# EAGLE design Old Shutter Driver with OptoCouplers (EAGLE 7.2.0)
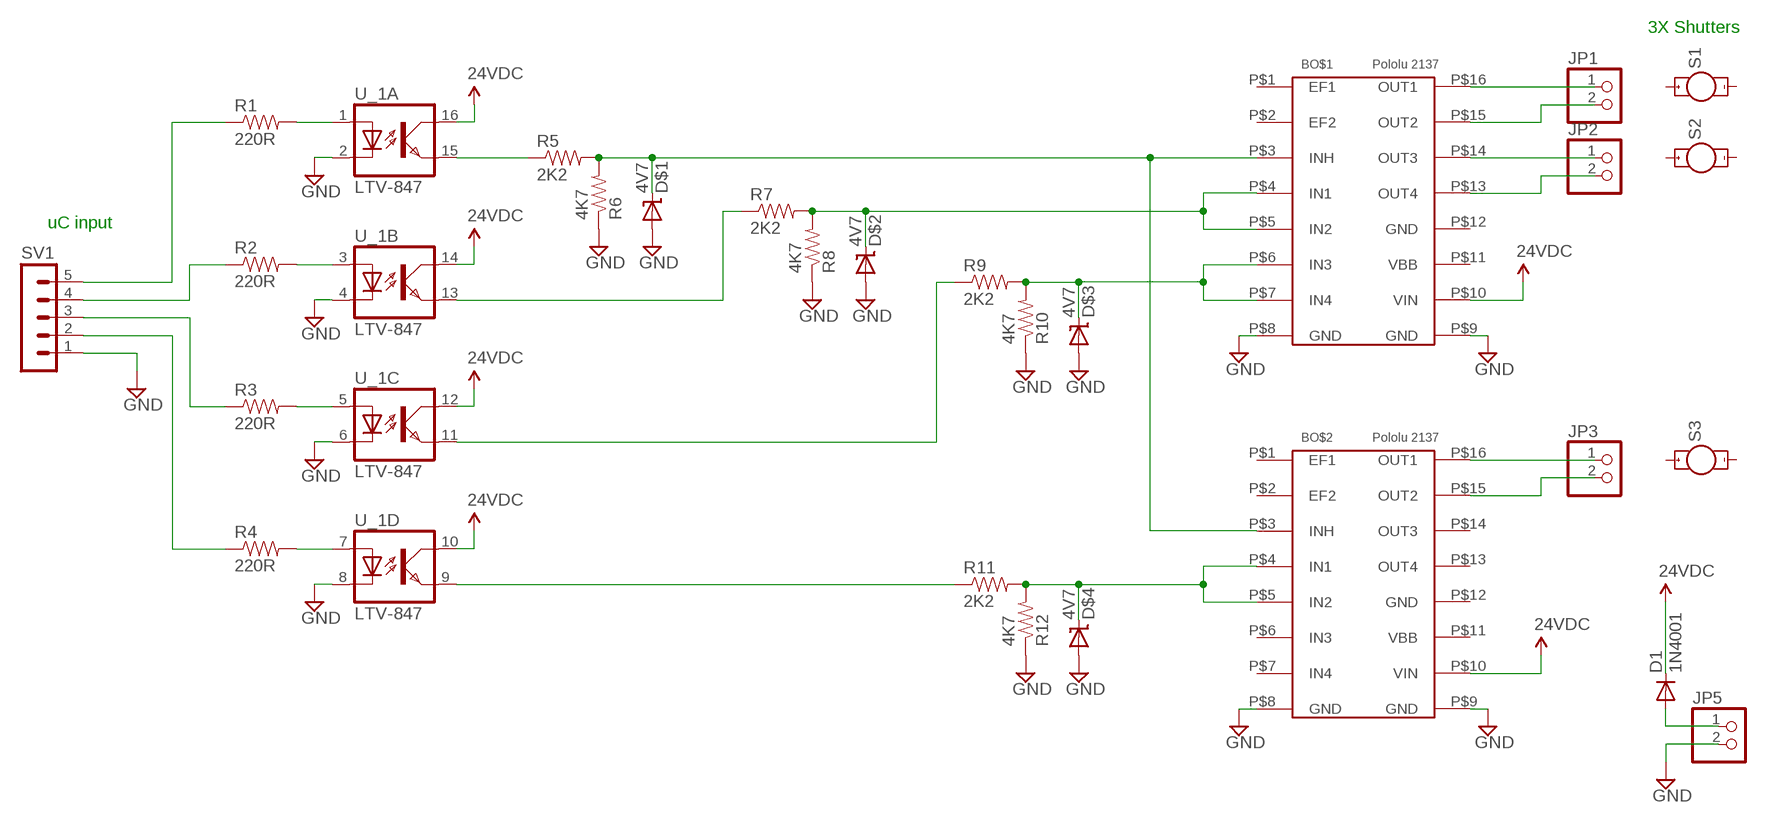
[diagram p0: schematic, sheet 1]

## Parts
BO$1  Pololu 2137  POLOLU2137  [POLOLU2137]
BO$2  Pololu 2137  POLOLU2137  [POLOLU2137]
D1  1N4001  1N4004  [DO41-10]
D$1  4V7  DIODE-ZENERPTH  [DIODE-ZENER]
D$2  4V7  DIODE-ZENERPTH  [DIODE-ZENER]
D$3  4V7  DIODE-ZENERPTH  [DIODE-ZENER]
D$4  4V7  DIODE-ZENERPTH  [DIODE-ZENER]
JP1  PINHD-1X2  [1X02]
JP2  PINHD-1X2  [1X02]
JP3  PINHD-1X2  [1X02]
JP5  PINHD-1X2  [1X02]
R1  220R  RESISTORAXIAL-0.3  [AXIAL-0.3]
R2  220R  RESISTORAXIAL-0.3  [AXIAL-0.3]
R3  220R  RESISTORAXIAL-0.3  [AXIAL-0.3]
R4  220R  RESISTORAXIAL-0.3  [AXIAL-0.3]
R5  2K2  RESISTORAXIAL-0.3  [AXIAL-0.3]
R6  4K7  RESISTORAXIAL-0.3  [AXIAL-0.3]
R7  2K2  RESISTORAXIAL-0.3  [AXIAL-0.3]
R8  4K7  RESISTORAXIAL-0.3  [AXIAL-0.3]
R9  2K2  RESISTORAXIAL-0.3  [AXIAL-0.3]
R10  4K7  RESISTORAXIAL-0.3  [AXIAL-0.3]
R11  2K2  RESISTORAXIAL-0.3  [AXIAL-0.3]
R12  4K7  RESISTORAXIAL-0.3  [AXIAL-0.3]
S1  MOTOR10MM  [VIBE-MOTOR-10MM]
S2  MOTOR10MM  [VIBE-MOTOR-10MM]
S3  MOTOR10MM  [VIBE-MOTOR-10MM]
SV1  MA05-1  [MA05-1]
U_1  LTV-847  LT847  [DIL16]

## Nets
GND: BO$1.P$8(GND) BO$1.P$9(GND) BO$2.P$8(GND) BO$2.P$9(GND) D$1.P$2(A) D$2.P$2(A) D$3.P$2(A) D$4.P$2(A) JP5.2 R6.P$1 R8.P$1 R10.P$1 R12.P$1 U_1.2(A:C) U_1.4(B:C) U_1.6(C:C) U_1.8(D:C)
INHIBIT1: BO$1.P$3(INH) BO$2.P$3(INH) D$1.P$1(C) R5.P$2 R6.P$2
INHIBIT2: BO$1.P$4(IN1) BO$1.P$5(IN2) D$2.P$1(C) R7.P$2 R8.P$2
INHIBIT3: BO$1.P$6(IN3) BO$1.P$7(IN4) D$3.P$1(C) R9.P$2 R10.P$2
INHIBIT4: BO$2.P$4(IN1) BO$2.P$5(IN2) D$4.P$1(C) R11.P$2 R12.P$2
N$1: BO$1.P$16(OUT1) JP1.1
N$2: BO$1.P$15(OUT2) JP1.2
N$3: R5.P$1 U_1.15(A:EMIT)
N$4: R7.P$1 U_1.13(B:EMIT)
N$5: R9.P$1 U_1.11(C:EMIT)
N$6: R11.P$1 U_1.9(D:EMIT)
N$7: R1.P$2 U_1.1(A:A)
N$8: R2.P$2 U_1.3(B:A)
N$9: R3.P$2 U_1.5(C:A)
N$10: R4.P$2 U_1.7(D:A)
N$11: BO$1.P$14(OUT3) JP2.1
N$12: BO$1.P$13(OUT4) JP2.2
N$13: BO$2.P$16(OUT1) JP3.1
N$14: BO$2.P$15(OUT2) JP3.2
N$15: D1.A JP5.1
N$18: R1.P$1 SV1.5
N$19: R2.P$1 SV1.4
N$20: R3.P$1 SV1.3
N$21: R4.P$1 SV1.2
VCC: BO$1.P$10(VIN) BO$2.P$10(VIN) D1.C U_1.10(D:COL) U_1.12(C:COL) U_1.14(B:COL) U_1.16(A:COL) ; supply symbol labelled 24VDC
Unconnected: BO$1.P$1(EF1) BO$1.P$2(EF2) BO$2.P$1(EF1) BO$2.P$2(EF2) BO$2.P$6(IN3) BO$2.P$7(IN4) BO$2.P$13(OUT4) BO$2.P$14(OUT3) S1.+ S1.- S2.+ S2.- S3.+ S3.- SV1.1

## Notes on the sheet
- 3X Shutters
- uC input

## Power pins joined to a net without a drawn wire
GND: BO$1.P$12(GND) BO$2.P$12(GND)
VBB: BO$1.P$11(VBB) BO$2.P$11(VBB)

## Library data of the parts
BO$1 BO$2 = au:POLOLU2137: Pololu item #2137 - Dual H-Bridge motor driver Details: Allegro A4990 controller DC motors 6 V to 32 V, 0.7 A each Peak current 0.9 A Inputs 3V and 5V compatible $5.95 each in November 2014 from pololu.com
D1 = adafruit:1N4004: DIODE General purpose 1N400x type rectifier (With bigger pads) http://www.ladyada.net/library/pcb/eaglelibrary.html
D$1-D$4 = SparkFun-DiscreteSemi:DIODE-ZENER: Zener Diode Production Part - 8199 3.4V Zener Voltage
JP1-JP3 JP5 = pinhead:PINHD-1X2: PIN HEADER
R1-R12 = SparkFun-Passives:RESISTOR: Resistor Basic schematic elements and footprints for 0603, 1206, and PTH resistors.
S1-S3 = SparkFun-Electromechanical:MOTOR: Vibration Motor- ROB-08449 Physical dimension and wire connections for this powerful vibration motor. Motor has a self adhesive backing.
SV1 = con-lstb:MA05-1: PIN HEADER; OC_FARNELL: unknown; OC_NEWARK: unknown
U_1 = LTV847:LT847

## Board
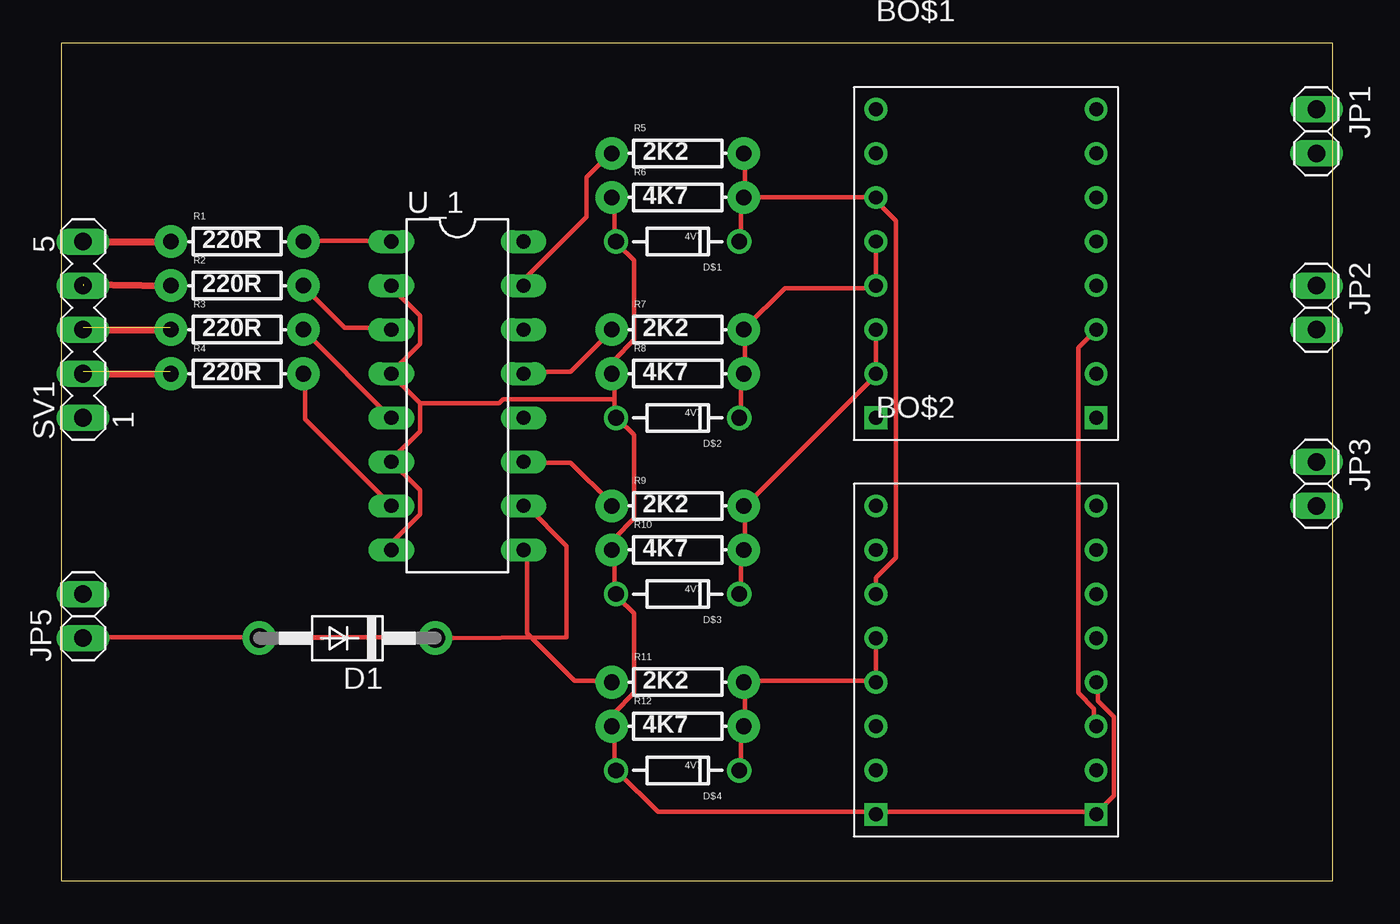
[diagram p1: board, top side]
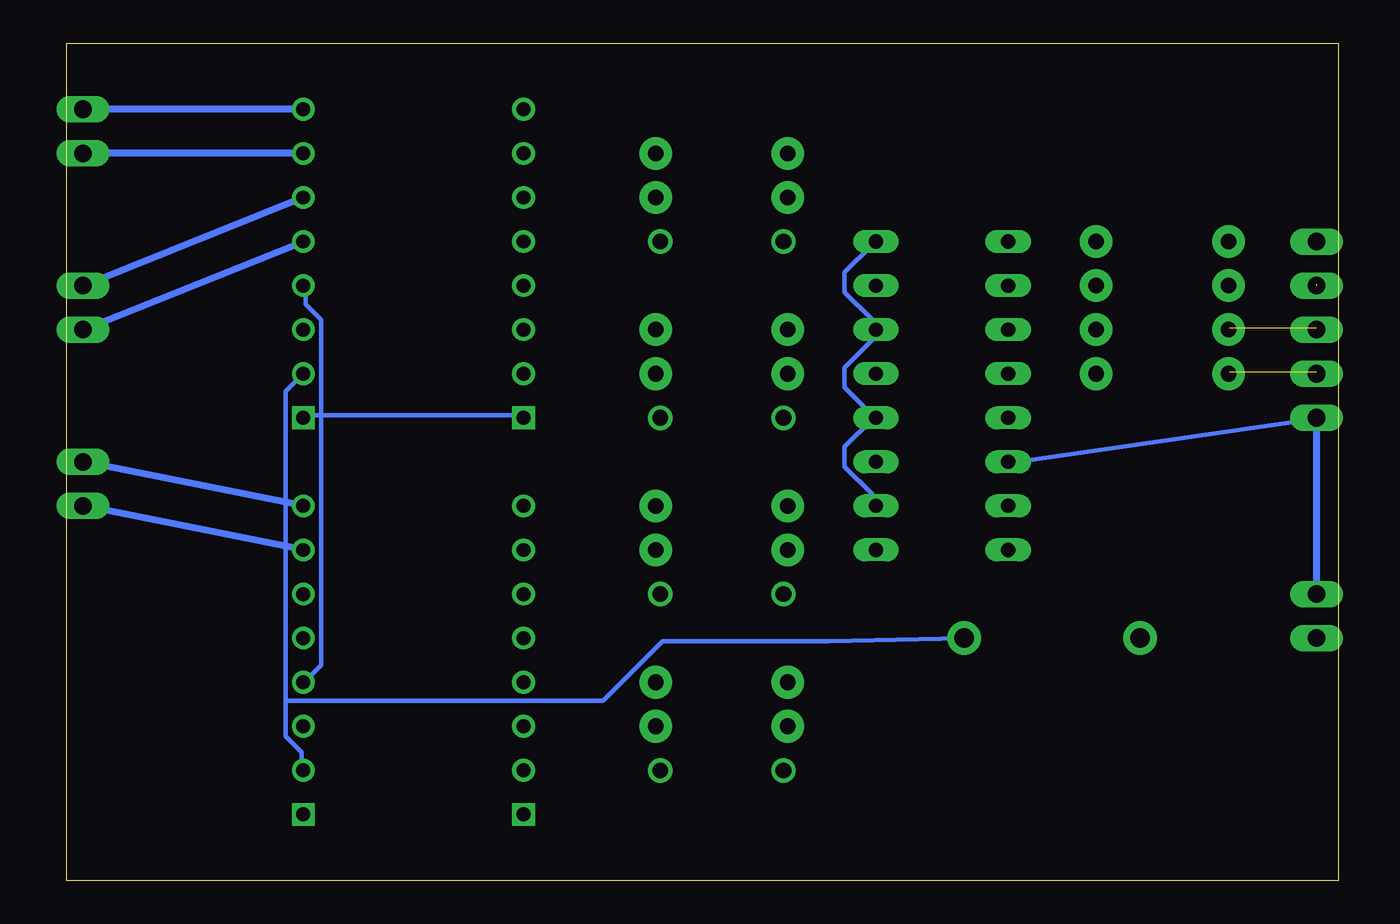
[diagram p2: board, bottom side, seen from below]

Size 73.33 x 48.25 mm. Coordinates in mm from the lower left corner, seen from the top.
Outline: 0,0 73.33,0 73.33,48.25 0,48.25 0,0
Copper layers (1*16): Top 0.035mm / dielectric 1.5mm / Bottom 0.035mm
Design rules "default": minimum track width 10mil, minimum drill 24mil, track to track 8mil, track to pad 8mil, pad to pad 8mil, via to via 8mil, smd to smd 8mil, copper to edge 40mil, drill to drill 8mil, minimum pad ring 10mil, minimum via ring 8mil, stop-mask expansion 4mil, vias tented up to drill 0mil, thermal gap 10mil

### Footprints (pad centres in the part's own frame; a part is rotated, then mirrored left to right if it is on the bottom)
POLOLU2137 = drill 0.8: P$1 -6.35,8.89; P$2 -6.35,6.35; P$3 -6.35,3.81; P$4 -6.35,1.27; P$5 -6.35,-1.27; P$6 -6.35,-3.81; P$7 -6.35,-6.35; P$10 6.35,-6.35; P$11 6.35,-3.81; P$12 6.35,-1.27; P$13 6.35,1.27; P$14 6.35,3.81; P$15 6.35,6.35; P$16 6.35,8.89 | drill 0.8 square: P$8 -6.35,-8.89; P$9 6.35,-8.89
DO41-10 = drill 1.118 pad 1.93: A 5.08,0; C -5.08,0
DIODE-ZENER = drill 0.9: P$1 -3.556,0; P$2 3.556,0
1X02 = drill 1.016 long: 1 -1.27,0; 2 1.27,0
AXIAL-0.3 = drill 0.9 pad 1.88: P$1 -3.81,0; P$2 3.81,0
VIBE-MOTOR-10MM = drill 0.8 pad 1.676: + -5,-3.9; - -6.35,-2.54
MA05-1 = drill 1.016 long: 1 -5.08,0; 2 -2.54,0; 3 0,0; 4 2.54,0; 5 5.08,0
DIL16 = drill 0.813 long: 1 -8.89,-3.81; 2 -6.35,-3.81; 3 -3.81,-3.81; 4 -1.27,-3.81; 5 1.27,-3.81; 6 3.81,-3.81; 7 6.35,-3.81; 8 8.89,-3.81; 9 8.89,3.81; 10 6.35,3.81; 11 3.81,3.81; 12 1.27,3.81; 13 -1.27,3.81; 14 -3.81,3.81; 15 -6.35,3.81; 16 -8.89,3.81

### Placement (x,y rotation side)
BO$1  53.34,35.56 0 top
BO$2  53.34,12.7 0 top
D1  16.51,13.97 180 top
D$1  35.56,36.83 180 top
D$2  35.56,26.67 180 top
D$3  35.56,16.51 180 top
D$4  35.56,6.35 180 top
JP1  72.39,43.18 270 top
JP2  72.39,33.02 270 top
JP3  72.39,22.86 270 top
JP5  1.27,15.24 90 top
R1  10.16,36.83 0 top
R2  10.16,34.29 0 top
R3  10.16,31.75 0 top
R4  10.16,29.21 0 top
R5  35.56,41.91 0 top
R6  35.56,39.37 0 top
R7  35.56,31.75 0 top
R8  35.56,29.21 0 top
R9  35.56,21.59 0 top
R10  35.56,19.05 0 top
R11  35.56,11.43 0 top
R12  35.56,8.89 0 top
S1  85.09,21.59 270 top  (outside the outline)
S2  85.09,31.75 270 top  (outside the outline)
S3  85.09,41.91 270 top  (outside the outline)
SV1  1.27,31.75 90 top
U_1  22.86,27.94 270 top

### Tracks (layer width: path | path; a pad name or v marks a point on that pad's centre or on a via)
GND
  Top 0.254: U_1.8 19.1,19.05 19.1,19.51 20.7,21.11 20.7,22.48 U_1.6 19.1,24.31 20.7,25.91 20.7,27.51 | U_1.2 19.1,34.14 20.7,32.54 20.7,30.94 19.1,29.34 U_1.4 19.1,29.11 20.7,27.51 | 46.99,3.96 59.56,3.96 BO$2.P$9 59.79,3.96 60.71,4.88 60.71,9.45 59.79,10.36 59.79,11.28 BO$2.P$12 | 31.9,19.05 31.9,16.53 D$3.P$2 32.13,16.31 33.05,15.39 33.05,10.82 31.9,9.68 31.9,8.99 R12.P$1 31.9,8.76 31.9,6.48 D$4.P$2 32.13,6.25 34.42,3.96 46.99,3.96 | 31.9,27.74 31.9,29.11 R8.P$1 31.9,29.34 31.9,30.02 33.05,31.17 33.05,35.74 32.13,36.65 D$1.P$2 31.9,36.88 31.9,39.17 R6.P$1 | 31.9,27.74 31.9,26.82 D$2.P$2 32.13,26.59 33.05,25.68 33.05,20.88 31.9,19.74 31.9,19.05 | 31.9,19.05 R10.P$1 | 46.99,3.96 BO$2.P$8 | 20.7,27.51 25.27,27.51 25.5,27.74 31.9,27.74
  Bottom 0.254: 1.27,26.62 18.87,24.08 U_1.6 | 58.65,26.82 59.56,26.82 BO$1.P$9 | 58.65,26.82 46.99,26.82 BO$1.P$8 | 58.65,26.82 58.65,32.31 59.56,33.22 59.56,34.14 BO$1.P$12 | 58.65,26.82 58.65,12.42 59.56,11.51 BO$2.P$12
  Bottom 0.406: 1.27,26.67 1.27,26.62 JP5.2
INHIBIT1
  Top 0.254: D$1.P$1 39.22,36.88 39.22,39.17 R6.P$2 39.45,39.39 | 39.45,39.39 39.45,41.91 R5.P$2 | BO$2.P$3 46.99,17.45 48.13,18.59 48.13,38.02 46.99,39.17 BO$1.P$3 46.99,39.39 39.45,39.39
INHIBIT2
  Top 0.254: D$2.P$1 39.22,26.82 39.22,29.11 R8.P$2 39.45,29.34 39.45,31.62 R7.P$2 39.45,31.85 41.73,34.14 46.99,34.14 BO$1.P$5 BO$1.P$4
INHIBIT3
  Top 0.254: D$3.P$1 39.22,16.53 39.22,19.05 R10.P$2 39.45,19.05 39.45,21.56 | BO$1.P$6 BO$1.P$7 46.99,29.11 39.45,21.56 | 39.45,21.56 R9.P$2
INHIBIT4
  Top 0.254: D$4.P$1 39.22,6.48 39.22,8.76 R12.P$2 39.45,8.99 39.45,11.28 R11.P$2 39.45,11.51 46.99,11.51 | BO$2.P$4 46.99,11.51 | 46.99,11.51 BO$2.P$5
N$1
  Bottom 0.406: BO$1.P$16 JP1.1
N$2
  Bottom 0.406: BO$1.P$15 JP1.2
N$3
  Top 0.254: U_1.15 26.87,34.37 26.87,34.82 30.3,38.25 30.3,40.54 31.67,41.91 R5.P$1
N$4
  Top 0.254: U_1.13 26.87,29.34 29.39,29.34 31.67,31.62 R7.P$1
N$5
  Top 0.254: U_1.11 26.87,24.08 29.39,24.08 31.67,21.79 R9.P$1
N$6
  Top 0.254: U_1.9 26.87,19.05 26.87,14.25 29.62,11.51 31.67,11.51 R11.P$1
N$7
  Top 0.254: U_1.1 18.87,36.88 14.07,36.88 R1.P$2
N$8
  Top 0.254: U_1.3 18.87,31.85 16.36,31.85 14.07,34.14 R2.P$2
N$9
  Top 0.254: U_1.5 18.87,26.82 14.07,31.62 R3.P$2
N$10
  Top 0.254: U_1.7 18.87,21.79 14.07,26.59 14.07,29.11 R4.P$2
N$11
  Bottom 0.406: BO$1.P$14 JP2.1
N$12
  Bottom 0.406: BO$1.P$13 JP2.2
N$13
  Bottom 0.406: BO$2.P$16 JP3.1
N$14
  Bottom 0.406: BO$2.P$15 JP3.2
N$15
  Top 0.254: JP5.1 1.27,14.02 18.87,14.02 D1.A
N$18
  Top 0.254: 6.3,36.88 R1.P$1
  Top 0.406: SV1.5 R1.P$1
N$19  (1 unrouted)
  Top 0.254: 6.3,34.37 R2.P$1
  Top 0.406: 1.27,34.37 R2.P$1
N$20  (1 unrouted)
  Top 0.254: 6.3,31.85 R3.P$1
  Top 0.406: SV1.3 R3.P$1
N$21  (1 unrouted)
  Top 0.254: 6.3,29.34 R4.P$1
  Top 0.406: SV1.2 R4.P$1
VBB
  Top 0.254: BO$1.P$11 58.65,30.71 58.65,10.82 59.56,9.91 59.56,8.99 BO$2.P$11
VCC
  Top 0.254: D1.C 29.16,14.02 29.16,19.28 26.87,21.56 U_1.10
  Bottom 0.254: 60.71,10.36 60.71,28.19 BO$1.P$10 | 60.71,10.36 60.71,8.31 59.79,7.39 59.79,6.48 BO$2.P$10 | U_1.16 26.87,36.65 28.47,35.05 28.47,33.91 26.87,32.31 26.87,31.85 U_1.14 26.87,31.62 26.87,31.17 28.47,29.57 28.47,28.42 26.87,26.82 U_1.12 26.87,26.59 28.47,24.99 28.47,23.85 26.87,22.25 26.87,21.79 U_1.10 | 60.71,10.36 42.42,10.36 38.99,13.79 29.39,13.79 D1.C